# Altium schematic sheet 02 ECE453-Digital-Interface.SchDoc
size C; PageSetup: Record=PageOptions|CenterHorizontal=True|CenterVertical=True|PrintScale=0.70|XCorrection=1.00|YCorrection=1.00|PrintKind=1|BorderSize=5000000|LeftOffset=0|BottomOffset=0|Orientation=2|PaperLength=1000|PaperWidth=1000|Scale=100|PaperSource=7|PrintQuality=-3|MediaType=1|DitherType=10|PrintScaleMode=1|PaperKind=Tabloid|PaperIndex=3
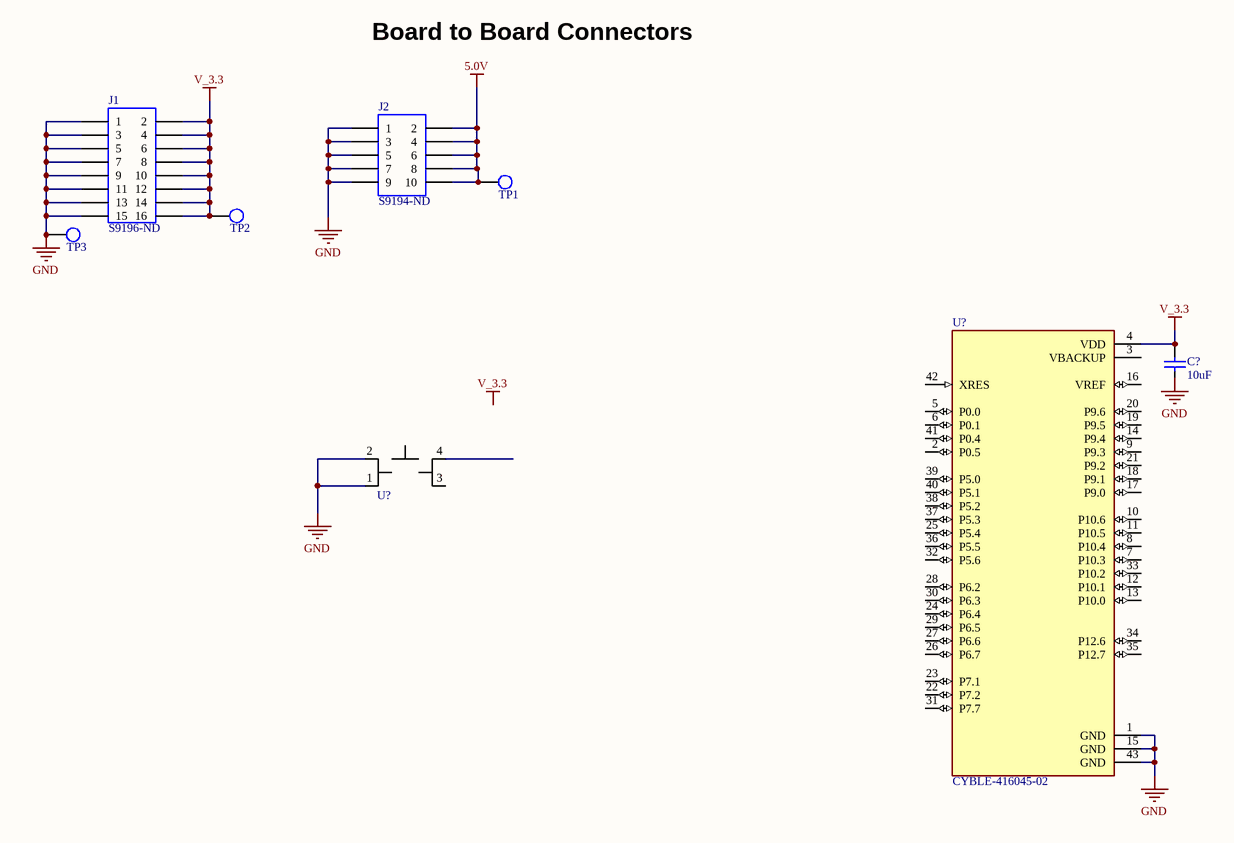
[diagram p0: 02 ECE453-Digital-Interface.SchDoc]

## Parts
(Parts that share a designator on the sheet are numbered #1, #2 ... from top to bottom, then left to right.)
C?  10uF  [CAP_0805]
J1  Supplier Part Number 1: S9196-ND  [SFH11-PBPC-D08-ST-BK]  (hidden comment: SFH11-PBPC-D08-ST-BK)
J2  Supplier Part Number 1: S9194-ND  [SFH11-PBPC-D05-ST-BK]  (hidden comment: SFH11-PBPC-D05-ST-BK)
TP1  TP_1206  [TP-SMC-1206]  (value not drawn)
TP2  TP_1206  [TP-SMC-1206]  (value not drawn)
TP3  TP_1206  [TP-SMC-1206]  (value not drawn)
U?#1  SWITCH_6mm_6mm_smd  [SWITCH_6mm_6mm_smd]  (value not drawn)
U?#2  CYBLE-416045-02  [XCVR_CYBLE-416045-02]

## Nets
5.0V: J2.2 J2.4 J2.6 J2.8 J2.10 TP1.1
GND: J1.1 J1.3 J1.5 J1.7 J1.9 J1.11 J1.13 J1.15 J2.1 J2.3 J2.5 J2.7 J2.9 TP3.1 U?#1.1 U?#1.2 U?#2.1(GND) U?#2.15(GND) U?#2.43(GND)
V_3.3: C?.2 J1.2 J1.4 J1.6 J1.8 J1.10 J1.12 J1.14 J1.16 TP2.1 U?#2.4(VDD)

Not connected (* = marked no-connect by the designer): C? 1; U?#1 3 4(VCCIO); U?#2 2(P0.5) 3(VBACKUP) 5(P0.0) 6(P0.1) 7(P10.3) 8(P10.4) 9(P9.3) 10(P10.6) 11(P10.5) 12(P10.1) 13(P10.0) 14(P9.4) 16(VREF) 17(P9.0) 18(P9.1) 19(P9.5) 20(P9.6) 21(P9.2) 22(P7.2) 23(P7.1) 24(P6.4) 25(P5.4) 26(P6.7) 27(P6.6) 28(P6.2) 29(P6.5) 30(P6.3) 31(P7.7) 32(P5.6) 33(P10.2) 34(P12.6) 35(P12.7) 36(P5.5) 37(P5.3) 38(P5.2) 39(P5.0) 40(P5.1) 41(P0.4) 42(XRES)

## Notes on the sheet
- Board to Board Connectors
- Labels drawn without touching a wire or pin: GND, V_3.3

## Library data of the parts
C? = CAP_0805_U_010.00: CAP CER 10UF 16V X7R 0805; Manufacturer: Samsung; Manufacturer Part Number: CL21A106KPCLQNC; Tolerance: 10%; Voltage Rating: 10V; Dielectric: X5R; ComponentLink3URL: https://datasheet.ciiva.com/26920/getdatasheetpartid-355170-26920201.pdf; ComponentLink3Description: https://datasheet.ciiva.com/26920/getdatasheetpartid-355170-26920201.pdf; Supplier: Digi-Key; Stock 1: 40000; Pricing 1: 1=0.22, 10=0.148, 100=0.0749, 500=0.05122, 1000=0.04531 (USD); Mount: Surface Mount; Case/Package: 0805; Case Code (Metric): 2012; Case Code (Imperial): 0805; Contact Plating: Tin; Min Operating Temperature: -55°C; Max Operating Temperature: 85°C; Packaging: Tape and Reel; Package Quantity: 1; Length: 2mm; Height: 0.85mm; Width: 0.049inch; Thickness: 0.037inch; Depth: 1.25mm; Radiation Hardening: No; ComponentLink1URL: https://datasheet.ciiva.com/25730/cl21a106kpclqnc-25730594.pdf; ComponentLink1Description: https://datasheet.ciiva.com/25730/cl21a106kpclqnc-25730594.pdf; Supplier Part Number: 1276-2402-1-ND; Capacitance: 10uF
J1 = SFH11-PBPC-D08-ST-BK: CONN HDR 10POS 0.1 GOLD PCB; Manufacturer 1: Sullins; Number of Positions: 16; Connector Type: Header,Socket; Pitch: 0.1inch; ComponentLink1URL: https://datasheet.ciiva.com/754/sfh11-pxxc-dxx-st-xx11160-c-754555.pdf?src-supplier=Digi-Key; ComponentLink1Description: https://datasheet.ciiva.com/754/sfh11-pxxc-dxx-st-xx11160-c-754555.pdf?src-supplier=Digi-Key; Supplier 1: Digi-Key; Manufacturer Part Number 1: SFH11-PBPC-D08-ST-BK; Stock 1: 0; Pricing 1: 1=1.04000, 10=0.91600, 100=0.79000, 500=0.64638, 1000=0.57456, 5000=0.51870 (USD); RoHS: Yes; Mount: Through Hole; Color: Black; Contact Plating: Gold; Package Quantity: 1; Number of Rows: 2; Packaging: Tray; Termination: Solder; Row Spacing: 0.1inch; Lead Free: Lead Free; ComponentLink2URL: https://datasheet.ciiva.com/754/sfh11-pxxc-dxx-st-xx11160-c-754557.pdf?src-supplier=Digi-Key; ComponentLink2Description: https://datasheet.ciiva.com/754/sfh11-pxxc-dxx-st-xx11160-c-754557.pdf?src-supplier=Digi-Key
J2 = SFH11-PBPC-D05-ST-BK: CONN HDR 10POS 0.1 GOLD PCB; Manufacturer 1: Sullins; Number of Positions: 10; Connector Type: Header; Pitch: 0.1inch; Supplier 1: Digi-Key; Manufacturer Part Number 1: SFH11-PBPC-D05-ST-BK; Stock 1: 26289; Pricing 1: 1=0.66000, 10=0.57600, 100=0.49700, 500=0.40662, 1000=0.36144, 5000=0.32630 (USD); RoHS: Yes; Mount: Through Hole; Color: Black; Contact Plating: Gold; Package Quantity: 1; Number of Rows: 2; Packaging: Tray; Termination: Solder; Row Spacing: 0.1inch; Lead Free: Lead Free; ComponentLink1URL: https://datasheet.ciiva.com/754/sfh11-pxxc-dxx-st-xx11160-c-754555.pdf?src-supplier=Digi-Key; ComponentLink1Description: https://datasheet.ciiva.com/754/sfh11-pxxc-dxx-st-xx11160-c-754555.pdf?src-supplier=Digi-Key
TP1-TP3 = TP_1206: Test Point SMD 1206; Supplier 1: Digi-Key; Supplier Part Number 1: A106143CT-ND
U?#1 = SWITCH_6mm_6mm_smd: SWITCH TACTILE SPST-NO 0.05A 12V; Manufacturer: C&K Components; Manufacturer Part Number: PTS645SH50SMTR92 LFS; Operating Force: 200gf; Illumination: Non-Illuminated; Switch Function: Off-Mom; Actuator Height off PCB, from Pins: 5.00mm; Actuator Type: Standard; Actuator Material: Polyamide (PA66), Nylon 6/6; Contact Rating @ Voltage: 0.05A @ 12VDC; Actuator Orientation: Top Actuated; Outline: 6.00mm x 6.00mm; Mechanical Life: 100,000 Cycles; Illumination Type, Color: -; Packaging: Tape & Reel (TR); Illumination Voltage (Nominal): -; Ingress Protection: -; Switch Travel: -; Category: Switches; Circuit: SPST-NO; Supplier: Digi-Key; Termination Style: Gull Wing; Features: -; Mounting Type: Surface Mount; Operating Temperature: -20°C ~ 60°C; RoHS: RoHS Compliant; Supplier Part Number: CKN9085TR-ND; Supplier 1: Digi-Key; Supplier Part Number 1: CKN9085CT-ND
U?#2 = CYBLE-416045-02: MF: {'manufacturer': u'Cypress Semiconductor'}; Value: *; Package: None; MP: CYBLE-416045-02; Price: None; Availability: Unavailable